# EAGLE design vco1_components (EAGLE 7.2.0)
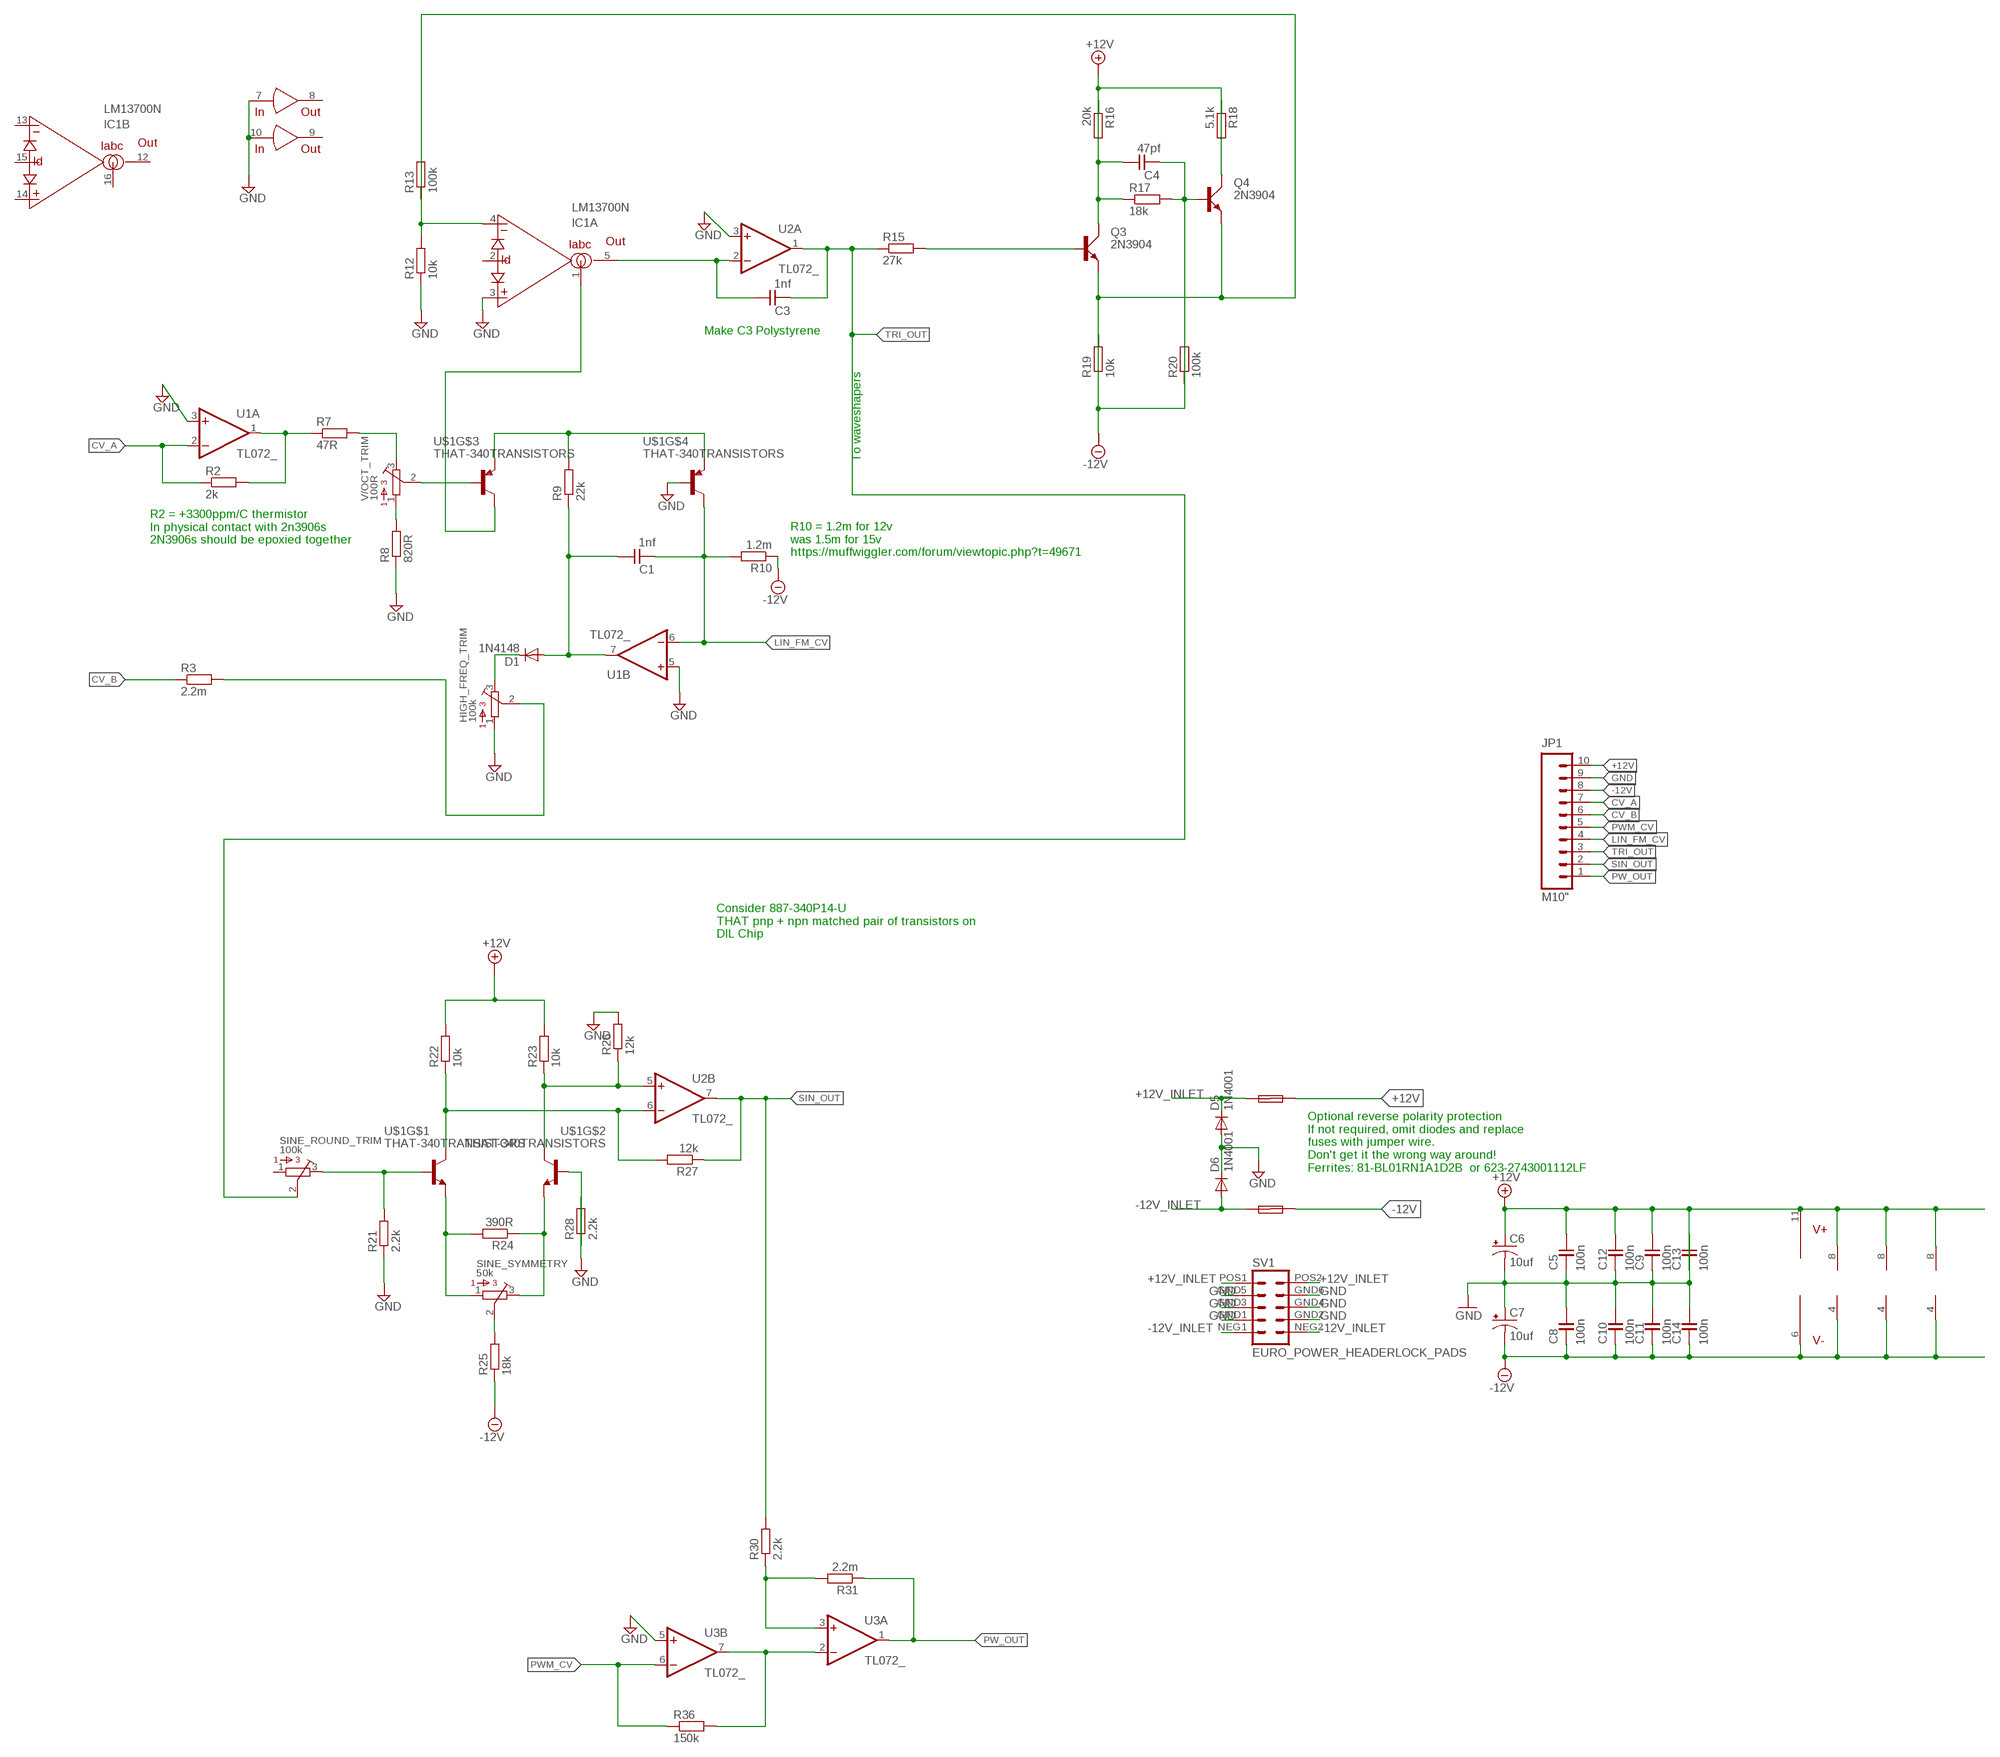
[diagram p0: schematic, sheet 1]

## Parts
C1  1nf  C-EU050-024X044  [C050-024X044]
C3  1nf  C-EU050-024X044  [C050-024X044]
C4  47pf  C-EU050-024X044  [C050-024X044]
C5  100n  C-EU050-024X044  [C050-024X044]
C6  10uf  CAP_POLPTH2  [CPOL-RADIAL-10UF-25V]
C7  10uf  CAP_POLPTH2  [CPOL-RADIAL-10UF-25V]
C8  100n  C-EU050-024X044  [C050-024X044]
C9  100n  C-EU050-024X044  [C050-024X044]
C10  100n  C-EU050-024X044  [C050-024X044]
C11  100n  C-EU050-024X044  [C050-024X044]
C12  100n  C-EU050-024X044  [C050-024X044]
C13  100n  C-EU050-024X044  [C050-024X044]
C14  100n  C-EU050-024X044  [C050-024X044]
D1  1N4148  SMALL_DIODEDO35-7  [DO35-7]
D5  1N4001  1N4004  [DO41-10]
D6  1N4001  1N4004  [DO41-10]
F1  FUSE  PTC_FUSEPOLY_FUSE  [C050H075X075]
F2  FUSE  PTC_FUSEPOLY_FUSE  [C050H075X075]
HIGH_FREQ_TRIM  100k  BOURNS_3362P_TRIMMERP  [BOURNS_3362P_TRIMMER]
IC1  LM13700N  [DIL16]
JP1  M10"  [1X10]
Q3  2N3904  [TO92D]
Q4  2N3904  [TO92D]
R2  2k  RESISTOR7MM  [7MM_RESISTOR]
R3  2.2m  RESISTOR7MM  [7MM_RESISTOR]
R7  47R  RESISTOR7MM  [7MM_RESISTOR]
R8  820R  RESISTOR7MM  [7MM_RESISTOR]
R9  22k  RESISTOR7MM  [7MM_RESISTOR]
R10  1.2m  RESISTOR7MM  [7MM_RESISTOR]
R12  10k  RESISTOR7MM  [7MM_RESISTOR]
R13  100k  RESISTOR7MM  [7MM_RESISTOR]
R15  27k  RESISTOR7MM  [7MM_RESISTOR]
R16  20k  RESISTOR7MM  [7MM_RESISTOR]
R17  18k  RESISTOR7MM  [7MM_RESISTOR]
R18  5.1k  RESISTOR7MM  [7MM_RESISTOR]
R19  10k  RESISTOR7MM  [7MM_RESISTOR]
R20  100k  RESISTOR7MM  [7MM_RESISTOR]
R21  2.2k  RESISTOR7MM  [7MM_RESISTOR]
R22  10k  RESISTOR7MM  [7MM_RESISTOR]
R23  10k  RESISTOR7MM  [7MM_RESISTOR]
R24  390R  RESISTOR7MM  [7MM_RESISTOR]
R25  18k  RESISTOR7MM  [7MM_RESISTOR]
R26  12k  RESISTOR7MM  [7MM_RESISTOR]
R27  12k  RESISTOR7MM  [7MM_RESISTOR]
R28  2.2k  RESISTOR7MM  [7MM_RESISTOR]
R30  2.2k  RESISTOR7MM  [7MM_RESISTOR]
R31  2.2m  RESISTOR7MM  [7MM_RESISTOR]
R36  150k  RESISTOR7MM  [7MM_RESISTOR]
SINE_ROUND_TRIM  100k  BOURNS_3362P_TRIMMERP  [BOURNS_3362P_TRIMMER]
SINE_SYMMETRY  50k  BOURNS_3362P_TRIMMERP  [BOURNS_3362P_TRIMMER]
SV1  EURO_POWER_HEADERLOCK_PADS  [EURO_PWR_HEADER_LOCK]
U1  TL072_  [DIL08]
U2  TL072_  [DIL08]
U3  TL072_  [DIL08]
U$1  THAT-340TRANSISTORS  [THAT340]
V/OCT_TRIM  100R  BOURNS_3362P_TRIMMERP  [BOURNS_3362P_TRIMMER]

## Nets
+12V: C5.1 C6.1(+) C9.1 C12.1 C13.2 F1.2 IC1.11(V+) JP1.10 R16.2 R18.2 R22.2 R23.2 U1.8(P:V+) U2.8(P:V+) U3.8(P:V+)
+12V_INLET [power]: D5.C F1.1 SV1.POS1 SV1.POS2
-12V: C7.2(-) C8.2 C10.2 C11.2 C14.2 F2.2 IC1.6(V-) JP1.8 R10.1 R19.2 R20.2 R25.1 U1.4(P:V-) U2.4(P:V-) U3.4(P:V-)
-12V_INLET [power]: D6.A F2.1 SV1.NEG1 SV1.NEG2
CV_A: JP1.7 R2.1 U1.2(A:-IN)
CV_B: JP1.6 R3.1
GND: C5.2 C6.2(-) C7.1(+) C8.1 C9.2 C10.1 C11.1 C12.2 C13.1 C14.1 D5.A D6.C HIGH_FREQ_TRIM.1 IC1.3(A:+IN) IC1.7(IN) IC1.10(IN) JP1.9 R8.1 R12.1 R21.1 R26.2 R28.2 SV1.GND1 SV1.GND2 SV1.GND3 SV1.GND4 SV1.GND5 SV1.GND6 U1.3(A:+IN) U1.5(B:+IN) U2.3(A:+IN) U3.5(B:+IN) U$1.9(B)
LIN_FM_CV: C1.2 JP1.4 R10.2 U1.6(B:-IN) U$1.8(C)
N$7: R2.2 R7.1 U1.1(A:OUT)
N$8: R7.2 V/OCT_TRIM.3
N$9: R8.2 V/OCT_TRIM.1
N$10: U$1.6(B) V/OCT_TRIM.2
N$11: R9.2 U$1.5(E) U$1.10(E)
N$12: IC1.1(A:IABC) U$1.7(C)
N$13: C1.1 D1.A R9.1 U1.7(B:OUT)
N$15: D1.C HIGH_FREQ_TRIM.3
N$16: HIGH_FREQ_TRIM.2 R3.2
N$21: IC1.4(A:-IN) R12.2 R13.2
N$22: C3.1 IC1.5(A:OUT) U2.2(A:-IN)
N$24: Q3.B R15.2
N$25: C4.1 Q3.C R16.1 R17.1
N$26: R21.2 SINE_ROUND_TRIM.3 U$1.2(B)
N$27: C4.2 Q4.B R17.2 R20.1
N$28: Q4.C R18.1
N$29: R25.2 SINE_SYMMETRY.2
N$30: Q3.E Q4.E R13.1 R19.1
N$31: R22.1 R27.2 U2.6(B:-IN) U$1.1(C)
N$32: R23.1 R26.1 U2.5(B:+IN) U$1.14(C)
N$33: R24.2 SINE_SYMMETRY.1 U$1.3(E)
N$34: R24.1 SINE_SYMMETRY.3 U$1.12(E)
N$35: R28.1 U$1.13(B)
N$38: R30.1 R31.2 U3.3(A:+IN)
N$40: R36.2 U3.2(A:-IN) U3.7(B:OUT)
PW_OUT: JP1.1 R31.1 U3.1(A:OUT)
PWM_CV: JP1.5 R36.1 U3.6(B:-IN)
SIN_OUT: JP1.2 R27.1 R30.2 U2.7(B:OUT)
TRI_OUT: C3.2 JP1.3 R15.1 SINE_ROUND_TRIM.2 U2.1(A:OUT)
Unconnected: IC1.2(A:ID) IC1.8(OUT) IC1.9(OUT) IC1.12(B:OUT) IC1.13(B:-IN) IC1.14(B:+IN) IC1.15(B:ID) IC1.16(B:IABC) SINE_ROUND_TRIM.1

## Notes on the sheet
- Make C3 Polystyrene
- To waveshapers
- R2 = +3300ppm/C thermistor
  In physical contact with 2n3906s
  2N3906s should be epoxied together
- R10 = 1.2m for 12v
  was 1.5m for 15v
  https://muffwiggler.com/forum/viewtopic.php?t=49671
- Consider 887-340P14-U
  THAT pnp + npn matched pair of transistors on 
  DIL Chip
- Optional reverse polarity protection
  If not required, omit diodes and replace
  fuses with jumper wire. 
  Don't get it the wrong way around! 
  Ferrites: 81-BL01RN1A1D2B  or 623-2743001112LF

## Library data of the parts
C1 C3-C5 C8-C14 = TomW:C-EU: CAPACITOR, European symbol
C6 C7 = SparkFun-Passives:CAP_POL: Capacitor Polarized These are standard SMD and PTH capacitors. Normally 10uF, 47uF, and 100uF in electrolytic and tantalum varieties. Always verify the external diameter of the through hole cap, it varies with capacity, voltage, and manufacturer. The EIA devices should be standard.
D1 = MusicThingModular:SMALL_DIODE: Small Signal Diode
D5 D6 = diode:1N4004: DIODE general purpose rectifier, 1 A
F1 F2 = TomW:PTC_FUSE
HIGH_FREQ_TRIM SINE_ROUND_TRIM SINE_SYMMETRY V/OCT_TRIM = MusicThingModular:BOURNS_3362P_TRIMMER: 3362 Series 1/4" Square Trimmer
IC1 = synthdiy:LM13700: National Dual OTA with buffers.
JP1 = SparkFun-Connectors:M10: Header 10 Standard 10-pin 0.1" header. Use with straight break away headers (SKU : PRT-00116), right angle break away headers (PRT-00553), swiss pins (PRT-00743), machine pins (PRT-00117), and female headers (PRT-00115).
Q3 Q4 = transistor-small-signal:2N3904: NPN TRANSISTOR
R2 R3 R7-R10 R12 R13 R15-R28 R30 R31 R36 = MusicThingModular:RESISTOR: Standard resistor, various versions
SV1 = MusicThingModular:EURO_POWER_HEADER: Power Header 10 pin power header for Eurorack Power Supplies Variants with fatter pads for easier soldering, and the LOCK variant which has 5mil offset pins to hold the component in place before soldering
U1-U3 = MusicThingModular:TL072: Generic Dual Op Amp
U$1 = MusicThingModular:THAT-340

## Net classes
1 power: width 0.406 mm
2 ground: width 0.305 mm

## Board
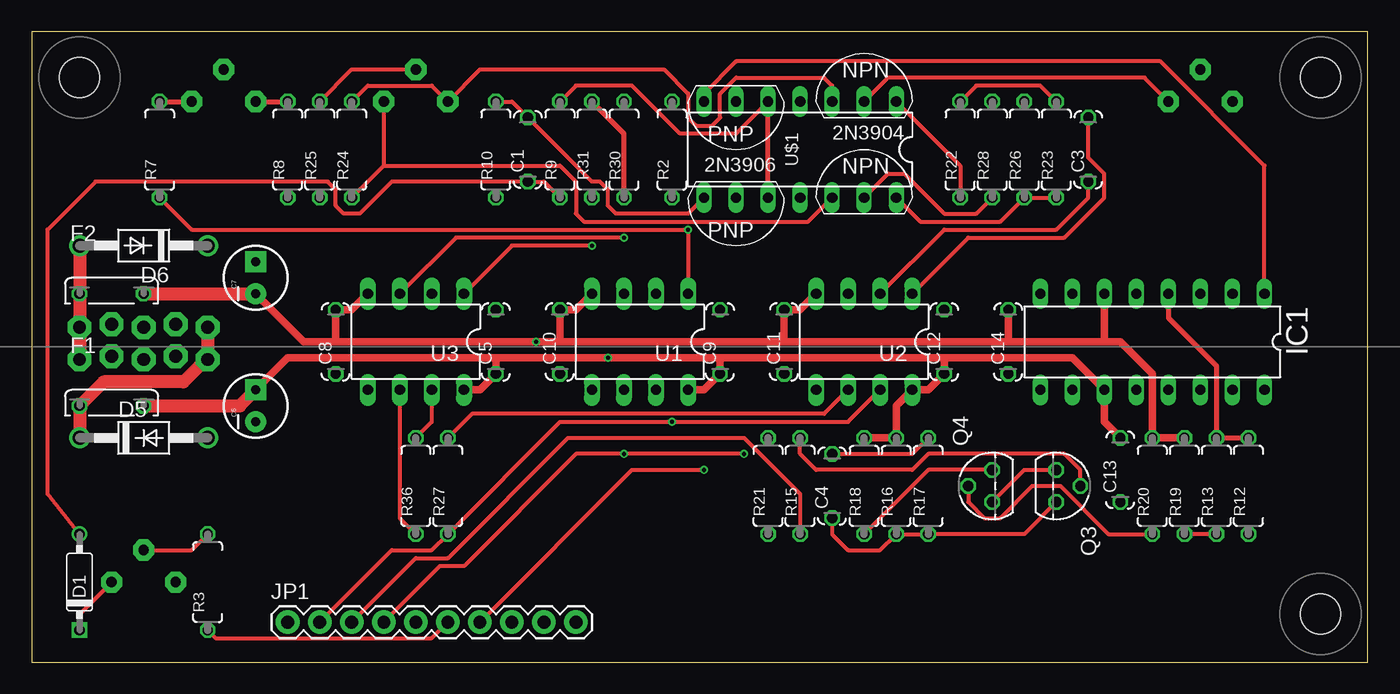
[diagram p1: board, top side]
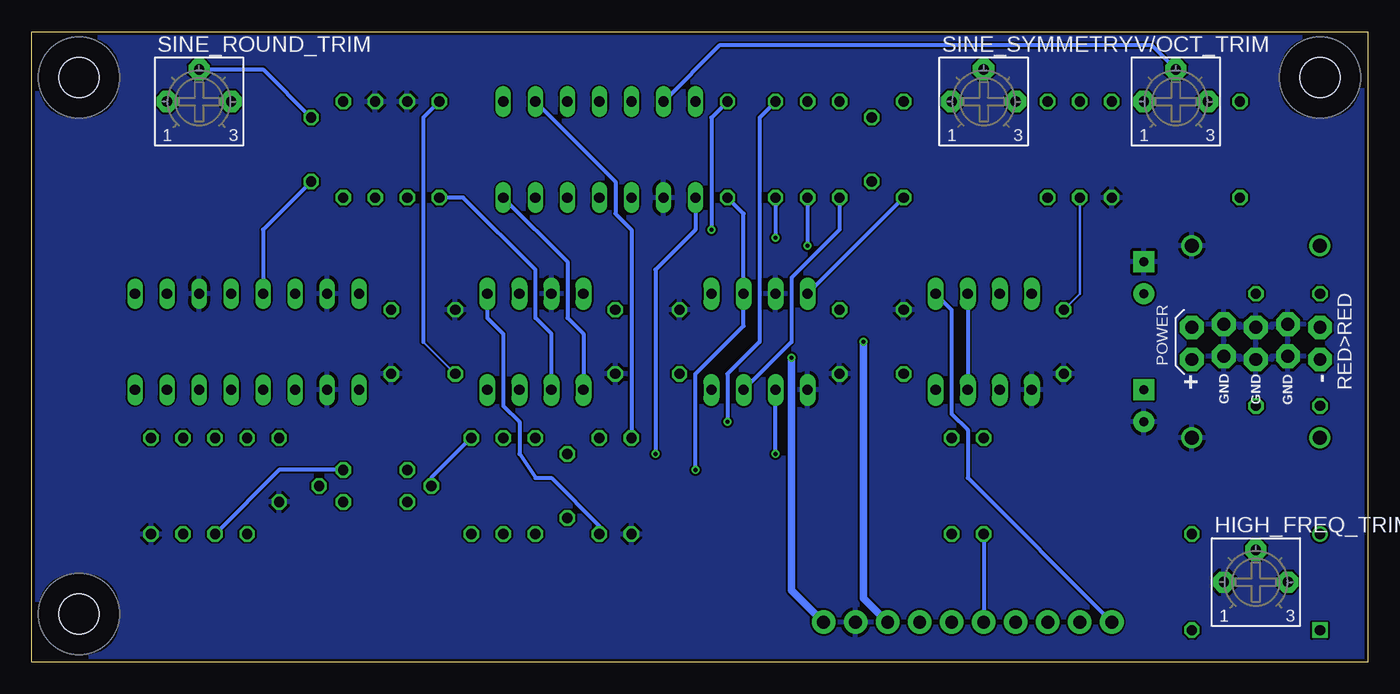
[diagram p2: board, bottom side, seen from below]

Size 106 x 50 mm. Coordinates in mm from the lower left corner, seen from the top.
Outline: 0,0 106,0 106,50 0,50 0,0
Copper layers (1*2*15*16): Top 0.035mm / dielectric 0.2mm / Route2 0.0175mm / dielectric 1.1mm / Route15 0.0175mm / dielectric 0.2mm / Bottom 0.035mm
Design rules "SeeedStudio_DRU_no_angle_20130527": minimum track width 6mil, minimum drill 12mil, track to track 6mil, track to pad 6mil, pad to pad 6mil, via to via 6mil, smd to smd 0mil, copper to edge 10mil, drill to drill 10mil, minimum pad ring 6mil, minimum via ring 6mil, stop-mask expansion 2mil, vias tented up to drill 25mil, thermal gap 10mil

### Footprints (pad centres in the part's own frame; a part is rotated, then mirrored left to right if it is on the bottom)
C050-024X044 = drill 0.813 octagon: 1 -2.54,0; 2 2.54,0
CPOL-RADIAL-10UF-25V = drill 0.7 pad 1.651 square: 1 1.27,0 | drill 0.7 pad 1.651: 2 -1.27,0
DO35-7 = drill 0.813: A 3.81,0 | drill 0.813 square: C -3.81,0
DO41-10 = drill 1.118: A 5.08,0; C -5.08,0
C050H075X075 = drill 0.813 octagon: 1 -2.54,0; 2 2.54,0
BOURNS_3362P_TRIMMER = drill 0.813 pad 1.676 octagon: 1 -2.54,0; 2 0,2.54; 3 2.54,0
DIL16 = drill 0.813 long: 1 -8.89,-3.81; 2 -6.35,-3.81; 3 -3.81,-3.81; 4 -1.27,-3.81; 5 1.27,-3.81; 6 3.81,-3.81; 7 6.35,-3.81; 8 8.89,-3.81; 9 8.89,3.81; 10 6.35,3.81; 11 3.81,3.81; 12 1.27,3.81; 13 -1.27,3.81; 14 -3.81,3.81; 15 -6.35,3.81; 16 -8.89,3.81
1X10 = drill 1.016 pad 1.88: 1 0,0; 2 2.54,0; 3 5.08,0; 4 7.62,0; 5 10.16,0; 6 12.7,0; 7 15.24,0; 8 17.78,0; 9 20.32,0; 10 22.86,0
TO92D = drill 0.813 octagon: B 0,1.905; C 1.27,0; E -1.27,0
7MM_RESISTOR = drill 0.813 octagon: 1 -3.81,0; 2 3.81,0
EURO_PWR_HEADER_LOCK = drill 1.016 pad 1.88 octagon: GND1 -2.54,1.143; GND2 -2.54,-1.397; GND3 0,1.397; GND4 0,-1.143; GND5 2.54,1.143; GND6 2.54,-1.397; NEG1 -5.08,1.397; NEG2 -5.08,-1.143; POS1 5.08,1.397; POS2 5.08,-1.143
DIL08 = drill 0.813 pad 1.27 long: 1 -3.81,-3.81; 2 -1.27,-3.81; 3 1.27,-3.81; 4 3.81,-3.81; 5 3.81,3.81; 6 1.27,3.81; 7 -1.27,3.81; 8 -3.81,3.81
THAT340 = drill 0.813 long: 1 -7.62,-3.81; 2 -5.08,-3.81; 3 -2.54,-3.81; 4 0,-3.81; 5 2.54,-3.81; 6 5.08,-3.81; 7 7.62,-3.81; 8 7.62,3.81; 9 5.08,3.81; 10 2.54,3.81; 11 0,3.81; 12 -2.54,3.81; 13 -5.08,3.81; 14 -7.62,3.81
MOUNTING_HOLE = hole 3.2: 0,0

### Placement (x,y rotation side)
C1  39.37,40.64 90 top
C3  83.82,40.64 90 top
C4  63.5,13.97 90 top
C5  36.83,25.4 90 top
C6  17.78,20.32 90 top
C7  17.78,30.48 90 top
C8  24.13,25.4 90 top
C9  54.61,25.4 90 top
C10  41.91,25.4 90 top
C11  59.69,25.4 90 top
C12  72.39,25.4 90 top
C13  86.36,15.24 90 top
C14  77.47,25.4 90 top
D1  3.81,6.35 90 top
D5  8.89,17.78 0 top
D6  8.89,33.02 180 top
F1  6.35,20.32 0 top
F2  6.35,29.21 0 top
HIGH_FREQ_TRIM  8.89,6.35 0 bottom
IC1  88.9,25.4 180 top
JP1  20.32,3.17 0 top
Q3  81.28,13.97 270 top
Q4  76.2,13.97 90 top
R2  50.8,40.64 90 top
R3  13.97,6.35 90 top
R7  10.16,40.64 90 top
R8  20.32,40.64 90 top
R9  41.91,40.64 90 top
R10  36.83,40.64 90 top
R12  96.52,13.97 90 top
R13  93.98,13.97 90 top
R15  60.96,13.97 90 top
R16  68.58,13.97 90 top
R17  71.12,13.97 90 top
R18  66.04,13.97 90 top
R19  91.44,13.97 90 top
R20  88.9,13.97 90 top
R21  58.42,13.97 90 top
R22  73.66,40.64 90 top
R23  81.28,40.64 90 top
R24  25.4,40.64 90 top
R25  22.86,40.64 90 top
R26  78.74,40.64 90 top
R27  33.02,13.97 90 top
R28  76.2,40.64 90 top
R30  46.99,40.64 90 top
R31  44.45,40.64 90 top
R36  30.48,13.97 90 top
SINE_ROUND_TRIM  92.71,44.45 0 bottom
SINE_SYMMETRY  30.48,44.45 0 bottom
SV1  8.89,25.4 180 bottom
U1  48.26,25.4 180 top
U2  66.04,25.4 180 top
U3  30.48,25.4 180 top
U$1  60.96,40.64 180 top
U$2  [MOUNTING_HOLE]  3.81,46.35 0 top
U$3  [MOUNTING_HOLE]  102.23,46.35 0 top
U$4  [MOUNTING_HOLE]  102.23,3.81 0 top
V/OCT_TRIM  15.24,44.45 0 bottom

### Tracks (layer width: path | path; a pad name or v marks a point on that pad's centre or on a via)
+12V  (via drill 0.33)
  Top 0.305: R23.2 80.01,45.72 74.93,45.72 R22.2
  Top 0.61: C6.1 20.32,24.13 36.83,24.13 | 36.83,24.13 v45.72,24.13 54.61,24.13 | 54.61,24.13 72.39,24.13 | 72.39,24.13 82.55,24.13 IC1.11 85.09,19.05 C13.2 | U3.8 35.56,21.59 C5.1 36.83,24.13 | U1.8 53.34,21.59 C9.1 54.61,24.13 | 72.39,24.13 C12.1 71.12,21.59 U2.8 68.58,20.32 R16.2 R18.2
  Top 1.016: F1.2 16.51,20.32 C6.1
  Bottom 0.203: 74.93,25.4 C12.1
  Bottom 0.305: R22.2 74.93,43.18 74.93,25.4
  Bottom 0.61: JP1.10 45.72,5.71 v45.72,24.13
+12V_INLET
  Top 1.016: SV1.POS2 SV1.POS1 13.84,24 12.06,22.23 5.71,22.23 F1.1 D5.C
-12V  (via drill 0.33)
  Top 0.61: C7.2 21.59,25.4 24.13,25.4 | 24.13,25.4 v40.01,25.4 41.91,25.4 | 41.91,25.4 59.69,25.4 | 59.69,25.4 77.47,25.4 | 77.47,25.4 85.09,25.4 | 85.09,25.4 IC1.6 | 24.13,25.4 C8.2 25.4,27.94 U3.4 | 41.91,25.4 C10.2 43.18,27.94 U1.4 | R19.2 R20.2 88.9,22.86 86.36,25.4 85.09,25.4 | 59.69,25.4 C11.2 60.96,27.94 U2.4 | 77.47,25.4 C14.2
  Top 1.016: F2.2 C7.2
  Bottom 0.203: R25.1 22.86,29.21 C8.2
  Bottom 0.305: R10.1 U1.4
  Bottom 0.61: JP1.8 40.01,5.08 v40.01,25.4
-12V_INLET
  Top 1.016: D6.A F2.1 SV1.NEG2 SV1.NEG1
CV_A  (via drill 0.33)
  Top 0.305: JP1.7 47.62,15.24 v53.34,15.24
  Bottom 0.305: v53.34,15.24 53.34,22.86 49.53,26.67 U1.2 49.53,35.56 R2.1
CV_B
  Top 0.305: R3.1 14.61,1.91 31.75,1.91 JP1.6
GND
  pour Bottom: -3.81,-1.27 107.95,-1.27 107.95,54.61 -3.81,54.61
LIN_FM_CV  (via drill 0.33)
  Top 0.305: R10.2 38.1,44.45 C1.2 44.45,38.1 45.09,38.1 45.72,37.47 45.72,36.2 46.35,35.56 52.07,35.56 U$1.8 | v56.52,16.51 v46.99,16.51 43.18,16.51 34.29,7.62 32.38,7.62 JP1.4
  Bottom 0.305: v46.99,16.51 U1.6 | U$1.8 53.34,34.29 56.52,31.11 v56.52,16.51
N$7  (via drill 0.33)
  Top 0.305: R7.1 12.7,34.29 v52.07,34.29 U1.1
  Bottom 0.305: R2.2 52.07,43.18 v52.07,34.29
N$8
  Top 0.406: R7.2 V/OCT_TRIM.3
N$9
  Top 0.406: V/OCT_TRIM.1 R8.2
N$10
  Bottom 0.305: V/OCT_TRIM.2 17.14,48.9 51.44,48.9 U$1.6
N$11
  Top 0.305: U$1.5 55.88,41.91 51.44,41.91 47.62,45.72 43.18,45.72 R9.2
  Top 0.406: U$1.10 U$1.5
N$12
  Top 0.305: IC1.1 97.79,39.37 89.53,47.62 55.88,47.62 53.34,45.09 U$1.7
N$13
  Top 0.305: D1.A 1.27,13.34 1.27,34.29 5.08,38.1 23.5,38.1 24.13,37.47 24.13,36.2 24.77,35.56 26.04,35.56 28.57,38.1 C1.1 40.64,38.1 R9.1
  Bottom 0.305: R9.1 41.91,34.29 45.72,30.48 45.72,25.4 U1.7
N$15
  Top 0.305: D1.C 3.81,3.81 HIGH_FREQ_TRIM.3
N$16
  Top 0.305: HIGH_FREQ_TRIM.2 12.7,8.89 R3.2
N$21
  Top 0.406: R12.2 R13.2 93.98,23.5 90.17,27.3 IC1.4
N$22
  Top 0.305: U2.2 72.39,34.29 81.28,34.29 83.82,36.83 C3.1
  Bottom 0.305: C3.1 87.63,34.29 IC1.5
N$24
  Top 0.305: Q3.B 83.19,15.24 81.92,16.51 71.12,16.51 69.85,15.24 62.23,15.24 60.96,16.51 R15.2
N$25
  Top 0.305: C4.1 63.5,10.16 64.77,8.89 67.31,8.89 R16.1 R17.1 78.74,10.16 Q3.C
N$26
  Top 0.305: SINE_ROUND_TRIM.3 88.27,46.35 67.94,46.35 U$1.2
  Bottom 0.305: U$1.2 59.69,38.1 59.69,35.56 58.42,34.29 R21.2
N$27
  Top 0.305: C4.2 69.85,16.51 R17.2 | Q4.B 74.3,12.7 75.56,11.43 76.83,11.43 79.38,13.97 81.6,13.97 85.41,10.16 R20.1
  Bottom 0.203: 74.3,14.61 Q4.B
  Bottom 0.305: R17.2 74.3,14.61
N$28
  Top 0.305: Q4.C 71.12,15.24 R18.1
N$29
  Top 0.305: R25.2 25.4,46.99 SINE_SYMMETRY.2
N$30
  Top 0.305: R13.1 R19.1 | Q4.E 78.74,15.24 Q3.E
  Bottom 0.305: Q3.E 86.36,15.24 R19.1
N$31
  Top 0.305: U2.6 62.87,19.68 34.92,19.68 R27.2 | U$1.1 73.66,39.37 R22.1
  Bottom 0.305: U2.6 64.77,26.04 66.04,27.3 66.04,31.11 71.75,36.83 R22.1
N$32
  Top 0.305: U$1.14 70.48,34.92 76.83,34.92 R26.1 R23.1
  Bottom 0.305: U$1.14 63.5,31.75 63.5,27.3 62.23,26.04 U2.5
N$33
  Top 0.305: R24.2 26.67,45.72 31.75,45.72 SINE_SYMMETRY.1 35.56,46.99 50.16,46.99 52.07,45.09 52.07,43.18 52.7,42.55 53.98,42.55 54.61,43.18 54.61,45.09 55.88,46.35 62.87,46.35 63.5,45.72 U$1.3
N$34
  Top 0.305: 27.94,39.37 41.91,39.37 43.18,38.1 43.18,35.56 43.81,34.92 61.59,34.92 U$1.12 | 27.94,39.37 R24.1 | SINE_SYMMETRY.3 27.94,39.37
N$35
  Top 0.305: U$1.13 67.94,38.73 69.22,38.73 72.39,35.56 74.93,35.56 R28.1
N$38  (via drill 0.33)
  Top 0.305: v46.99,33.66 33.66,33.66 U3.3
  Top 0.406: R30.1 46.99,41.91 R31.2
  Bottom 0.305: R30.1 v46.99,33.66
N$40
  Top 0.305: U3.7 31.75,19.05 R36.2
  Bottom 0.305: U3.2 U3.7
PW_OUT  (via drill 0.33)
  Top 0.305: v44.45,33.02 38.1,33.02 U3.1
  Bottom 0.305: R31.1 v44.45,33.02 | U3.1 33.02,27.94 33.02,19.68 31.75,18.41 31.75,14.61 JP1.1
PWM_CV
  Top 0.305: U3.6 29.21,11.43 R36.1
  Bottom 0.305: R36.1 JP1.5
SIN_OUT  (via drill 0.33)
  Top 0.305: JP1.2 28.57,8.89 31.75,8.89 R27.1 41.91,19.05 v50.8,19.05 64.77,19.05 U2.7
  Bottom 0.305: R30.2 48.26,43.18 48.26,25.4 50.8,22.86 v50.8,19.05
TRI_OUT
  Top 0.305: R15.1 60.96,13.34 56.52,17.78 42.55,17.78 33.02,8.26 30.48,8.26 JP1.3 | U2.1 74.3,33.66 81.92,33.66 85.09,36.83 85.09,38.73 83.82,40.01 C3.2
  Bottom 0.305: SINE_ROUND_TRIM.2 87.63,46.99 C3.2 | U2.1 69.85,27.3 68.58,26.04 68.58,20.32 67.31,19.05 67.31,16.51 66.04,14.61 64.77,14.61 60.96,10.79 R15.1